# Altium schematic sheet rf_transmit.SchDoc
size A; SheetNumber: 15; SheetTotal: 17
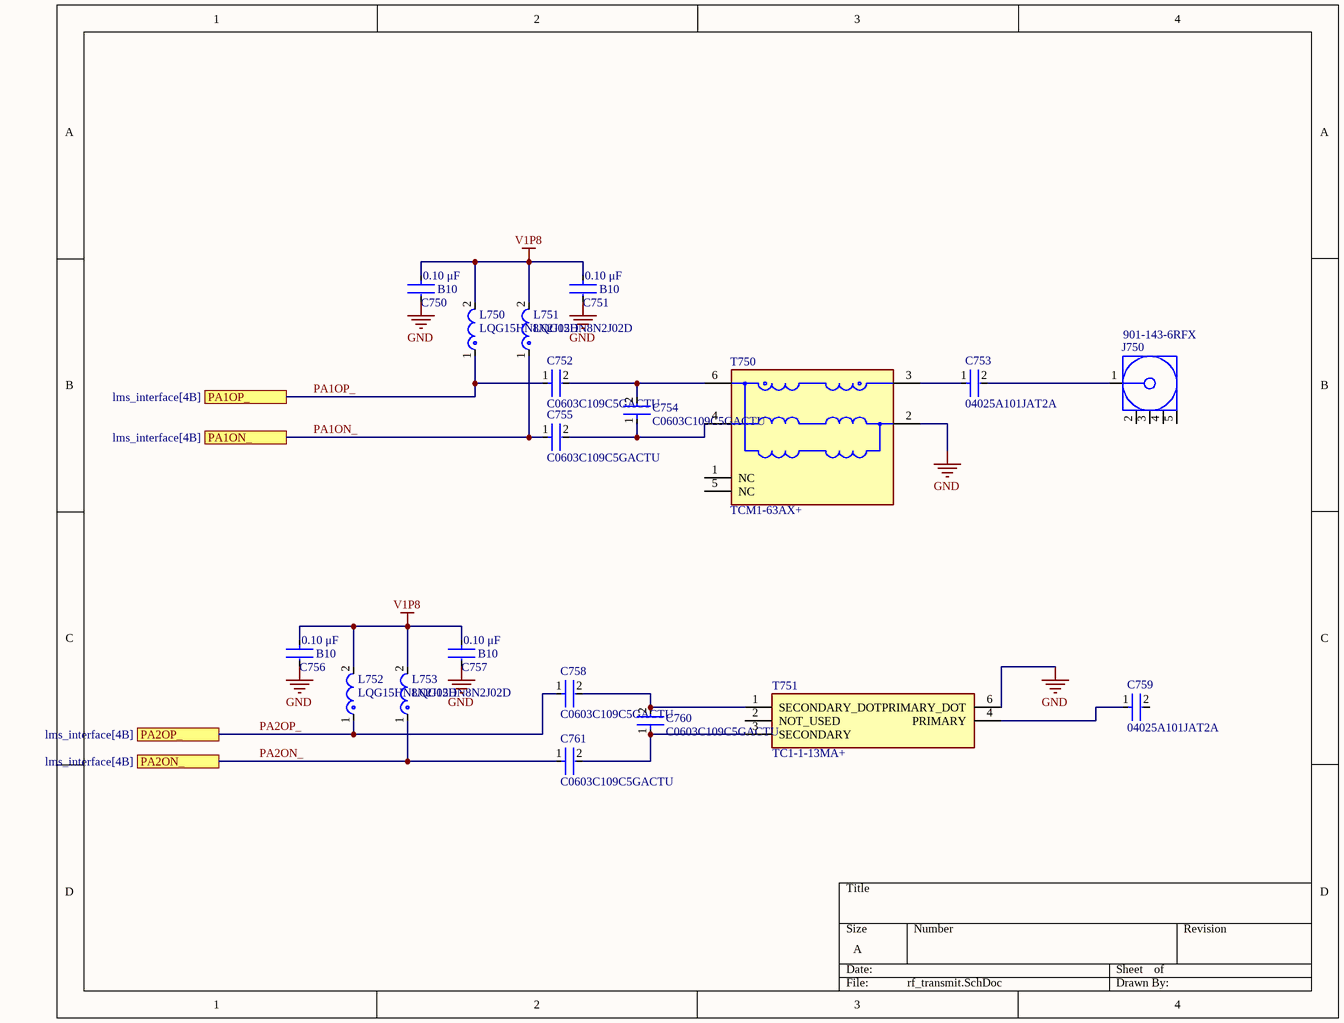
[diagram p0: rf_transmit.SchDoc]

## Parts
C750  B10  Capacitance: 0.10 μF  [FP-C0603C-CF-MFG]
C751  B10  Capacitance: 0.10 μF  [FP-C0603C-CF-MFG]
C752  C0603C109C5GACTU  [FP-C0603C-CF-MFG]
C753  04025A101JAT2A  [FP-0402-L_1_0_1-W_0_5_0_1-MFG]
C754  C0603C109C5GACTU  [FP-C0603C-CF-MFG]
C755  C0603C109C5GACTU  [FP-C0603C-CF-MFG]
C756  B10  Capacitance: 0.10 μF  [FP-C0603C-CF-MFG]
C757  B10  Capacitance: 0.10 μF  [FP-C0603C-CF-MFG]
C758  C0603C109C5GACTU  [FP-C0603C-CF-MFG]
C759  04025A101JAT2A  [FP-0402-L_1_0_1-W_0_5_0_1-MFG]
C760  C0603C109C5GACTU  [FP-C0603C-CF-MFG]
C761  C0603C109C5GACTU  [FP-C0603C-CF-MFG]
J750  901-143-6RFX  [AMPH-901-143-6RFX_V]
L750  LQG15HN8N2J02D  [FP-LQG15HH_02-MFG]
L751  LQG15HN8N2J02D  [FP-LQG15HH_02-MFG]
L752  LQG15HN8N2J02D  [FP-LQG15HH_02-MFG]
L753  LQG15HN8N2J02D  [FP-LQG15HH_02-MFG]
T750  TCM1-63AX+  [FP-TCM1-63AX+-MFG]
T751  TC1-1-13MA+  [TC1113MA]

## Ports
PA1ON_ (see lms_interface[4B]), PA1OP_ (see lms_interface[4B]), PA2ON_ (see lms_interface[4B]), PA2OP_ (see lms_interface[4B])

## Nets
GND: C750.2 C751.2 C756.2 C757.2 T750.2(GND) T751.6(PRIMARY_DOT)
V1P8: C750.1 C751.1 C756.1 C757.1 L750.2 L751.2 L752.2 L753.2
PA1ON_: C755.1 L751.1 ; port PA1ON_
PA1OP_: C752.1 L750.1 ; port PA1OP_
PA2ON_: C761.1 L753.1 ; port PA2ON_
PA2OP_: C758.1 L752.1 ; port PA2OP_
NetC752_2: C752.2 C754.2 T750.6(SECONDARY_DOT)
NetC753_1: C753.1 T750.3(PRIMARY_DOT)
NetC753_2: C753.2 J750.1
NetC754_1: C754.1 C755.2 T750.4(SECONDARY)
NetC758_2: C758.2 C760.2 T751.1(SECONDARY_DOT)
NetC759_1: C759.1 T751.4(PRIMARY)
NetC760_1: C760.1 C761.2 T751.3(SECONDARY)

Not connected (* = marked no-connect by the designer): C759 2; J750 2 3 4 5; T750 1(NC) 5(NC); T751 2(NOT_USED)

## Library data of the parts
C750 C751 C756 C757 = CMP-2006-03061-2: CAP CER 0.1UF 50V X7R 0603; Manufacturer: KEMET; Manufacturer Part Number: C0603C104K5RACTU; Tolerance: 0.1; Temperature Coefficient: 30ppm/°C; Material: Ceramic; Automotive Grade: Grade 1; Value: 0.10 μF; Temperature: -55°C to +125°C; RoHS: TRUE; Temperature Range High: +125°C; Lead Free: Yes; Octopart: https://octopart.com/c0603c104k5ractu-kemet-139244; Digikey Description: CAP CER 0.1UF 50V X7R 0603; Category: Cap; Package: C0603C-CF; ComponentLink2Description: Datasheet; Temperature Range Low: -55°C; Device Class L1: Passive Components; Voltage Rating: 50 V; Automotive: Yes; Device Class L3: Ceramic Capacitors; ComponentLink2URL: https://api.kemet.com/component-edge/download/datasheet/C0603C100J5GACAUTO.pdf; Device Class L2: Capacitors; Temperature Characteristic: X7R; Height: 0.87mm
C752 C754 C755 C758 C760 C761 = CMP-2006-03328-2: CAP CER 1PF 50V C0G/NP0 0603; Manufacturer: KEMET; Value: 1.0 pF; Temperature Characteristic: C0G; Tolerance: 0.25 pF; Temperature Coefficient: 30ppm/°C; Automotive Grade: Grade 1; Material: Ceramic; Device Class L1: Passive Components; Temperature Range High: +125°C; Temperature: -55°C to +125°C; Height: 0.87mm; Digikey Description: CAP CER 1PF 50V C0G/NP0 0603; Voltage Rating: 50 V; ComponentLink2Description: Datasheet; Capacitance: 1.0 pF; Lead Free: Yes; ComponentLink2URL: https://api.kemet.com/component-edge/download/datasheet/C0603C100J5GACAUTO.pdf; Mouser Description: Multilayer Ceramic Capacitors MLCC - SMD/SMT 50volts 1.0pF C0G 0.25%; Temperature Range Low: -55°C; Device Class L3: Ceramic Capacitors; Device Class L2: Capacitors; Automotive: Yes; RoHS: TRUE; Package: C0603C-CF; Category: Cap; Manufacturer Part Number: C0603C109C5GACTU; Octopart: https://octopart.com/c0603c109c5gactu-kemet-107248
C753 C759 = CMP-2008-02568-3: General Purpose Ceramic Capacitor, 0402, 100pF, 5%, C0G, 30ppm/°C, 50V; Insulation Resistance: 1GR; Dissipation Factor: 2.5%; REACH SVHC: No SVHC; Termination: SMD/SMT; Construction: Flat; Voltage: 50V; Contact Plating: Tin; Width: 0.02inch; Series: -; Voltage Rating (DC): 50V; Voltage Rating: 50V; Height: 0.56mm; Tolerance: 5%; Dielectric: C0G; Max Operating Temperature: 125°C; Length: 1mm; Lead Free: Lead Free; Case/Package: 0402; Min Operating Temperature: -55°C; Depth: 0.5mm; Case Code (Metric): 1005; Thickness: 0.022inch; Radiation Hardening: No; Temperature Coefficient: 30ppm/°C; Case Code (Imperial): 0402; Mount: Surface Mount; Capacitance: 100pF; Packaging: Tape and Reel; Package Quantity: 1; RoHS Compliant: Yes
J750 = CMP-2000-05705-1: Coaxial connector, 50 Ohm, -65 to 165 degC, 5-Pin THD, RoHS, Bulk; Manufacturer: Amphenol; Catalog Drawings: 901-143-6RFXMountingHole; 3D Model: 901-143-6RFX.igs; Body Material: Brass; Connector Type: Jack,FemaleSocket; Shield Termination: Solder; Other Names: 901-143-6-RFX9011436RFXARFX1232; Online Catalog: SMA,RFX; Frequency - Max: 18GHz; Body Finish: Gold; Dielectric Material: Polytetrafluoroethylene(PTFE); Center Contact Material: BerylliumCopper; Impedance: 50Ohm; Connector Style: SMA; Mounting Technology: ThroughHole; Mounting Type: ThroughHole,RightAngle; Cable Group: -; Series: -; Package Description: 5-Pin Through Hole Device, Body 7 x 7 mm, Pitch 2.54 mm; Package Reference: 901-143-6RFX; Voltage Rating: -; Standard Package: 1; Fastening Type: Threaded; Housing Color: Gold; Datasheet URL: http://www.amphenolrf.com/downloads/dl/file/id/2712/product/3102/901_143_6rfx_customer_drawing.pdf; Family: CoaxialConnectors(RF); Contact Termination: Solder; Manufacturer URL: http://www.amphenol.com/; Operating Temperature: -65°C~165°C; Category: Connectors,Interconnects; Packaging: Bulk; Features: -; Center Contact Plating: Gold; Datasheet Version: Rev. C, 06/2010; Ingress Protection: -
L750-L753 = CMP-06042-008586-1: Multilayer type RF Inductor 8.2nH ±5% 0.25Ω 500mA 0402; Core Material: Air; Shielding: Unshielded; Current Rating: 300mA; Test Frequency: 100MHz; Self Resonant Frequency: 3.6GHz; Q Factor: 8; DC Resistance (DCR): 330mR; Case/Package: 0402; Max Operating Temperature: 125°C; Military Standard: Not; Depth: 0.55mm; Lead Free: Lead Free; DC Current: 300mA; Length: 1mm; Height: 0.02inch; Width: 0.5mm; Termination: SMD/SMT; Max DC Current: 300mA; Min Operating Temperature: -55°C; Height - Seated (Max): 0.022inch; Radiation Hardening: No; Inductance: 8.2nH; Packaging: Tape and Reel; REACH SVHC: No SVHC; Case Code (Imperial): 0402; Package Quantity: 1; Tolerance: 5%; Case Code (Metric): 1005; Mount: Surface Mount; Inductance Tolerance: 5%
T750 = CMP-199822-000001-1: 1:1 CORE & WIRE Transformer, 10 - 6000 MHz, 50Ω; Manufacturer: Mini-Circuits; Insertion Loss: 1.16-1.8dB; Return Loss: 9.42-16.9dB; Lead Free: Yes; Device Class L3: unset; Temperature: -40°C to +85°C; Manufacturer Part Number: TCM1-63AX+; Frequency: 10-6000MHz; Device Class L2: Transformers; RoHS: TRUE; Octopart: https://octopart.com/tcm1-63ax%2B-mini-circuits-107315723; Temperature Range Low: -40°C; Category: Trans; Package: 0; ComponentLink2URL: https://www.minicircuits.com/pdfs/TCM1-63AX+.pdf; ComponentLink2Description: Datasheet; Automotive: No; Height: 4.06mm; Device Class L1: Passive Components; Temperature Range High: +85°C; Turns Ratio: 1:1
T751 = TC1-1-13MA+: Transformer; Manufacturer_Name: Mini-Circuits; Datasheet Link: https://www.minicircuits.com/pdfs/TC1-1-13MA+.pdf; Height: 4.06mm; Manufacturer_Part_Number: TC1-1-13MA+; Mouser Part Number: 139-TC1-1-13MA; Mouser Price/Stock: https://www.mouser.co.uk/ProductDetail/Mini-Circuits/TC1-1-13MA%2b?qs=xZ%2FP%252Ba9zWqaQyucfPXsKqA%3D%3D